# EAGLE design quadcopter (EAGLE 9.7.0)
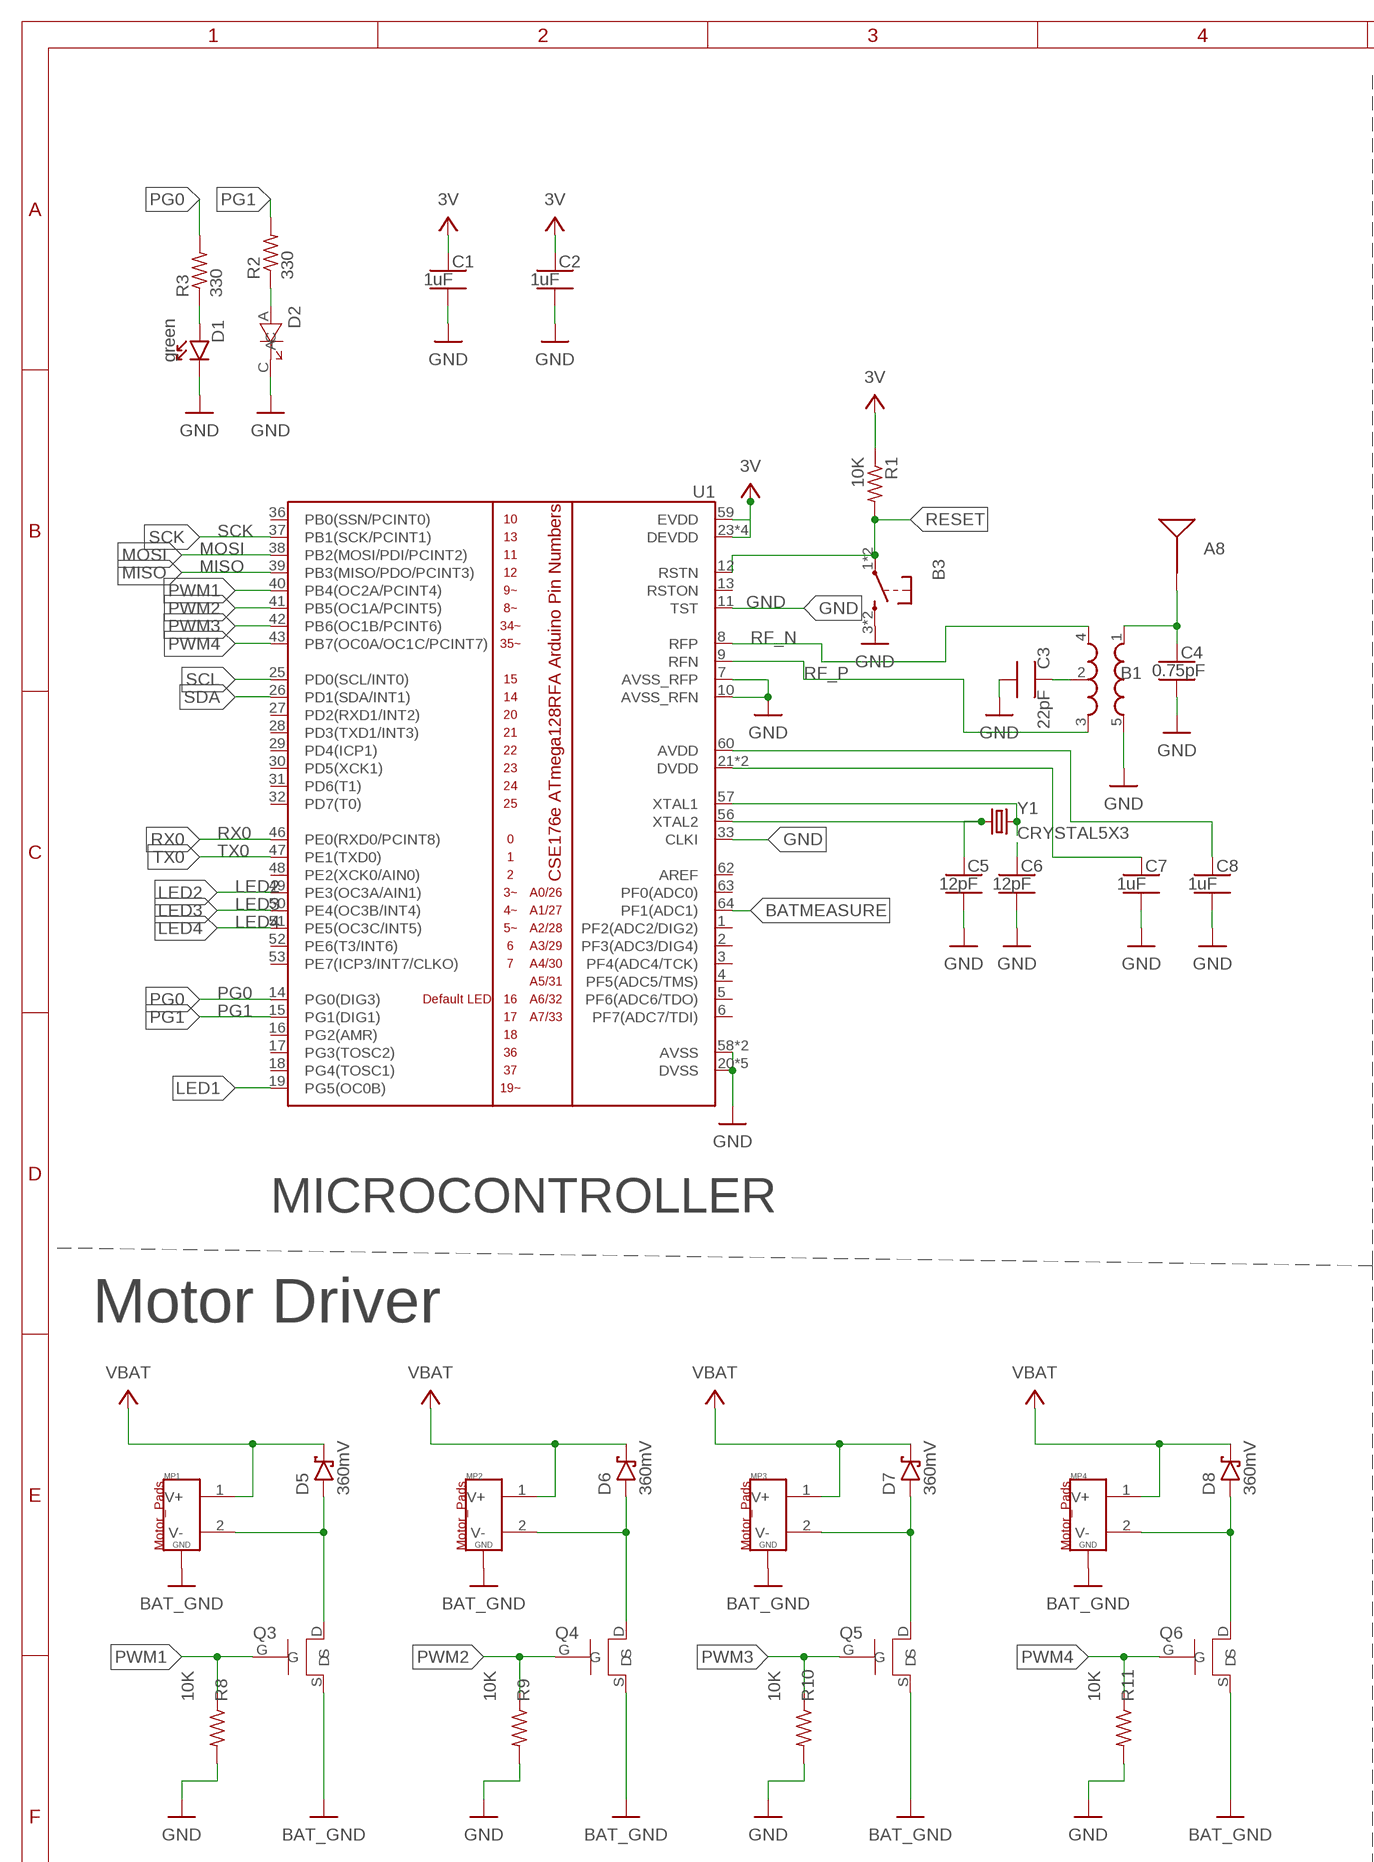
[diagram p0: schematic, sheet 1, part 1 of 2]
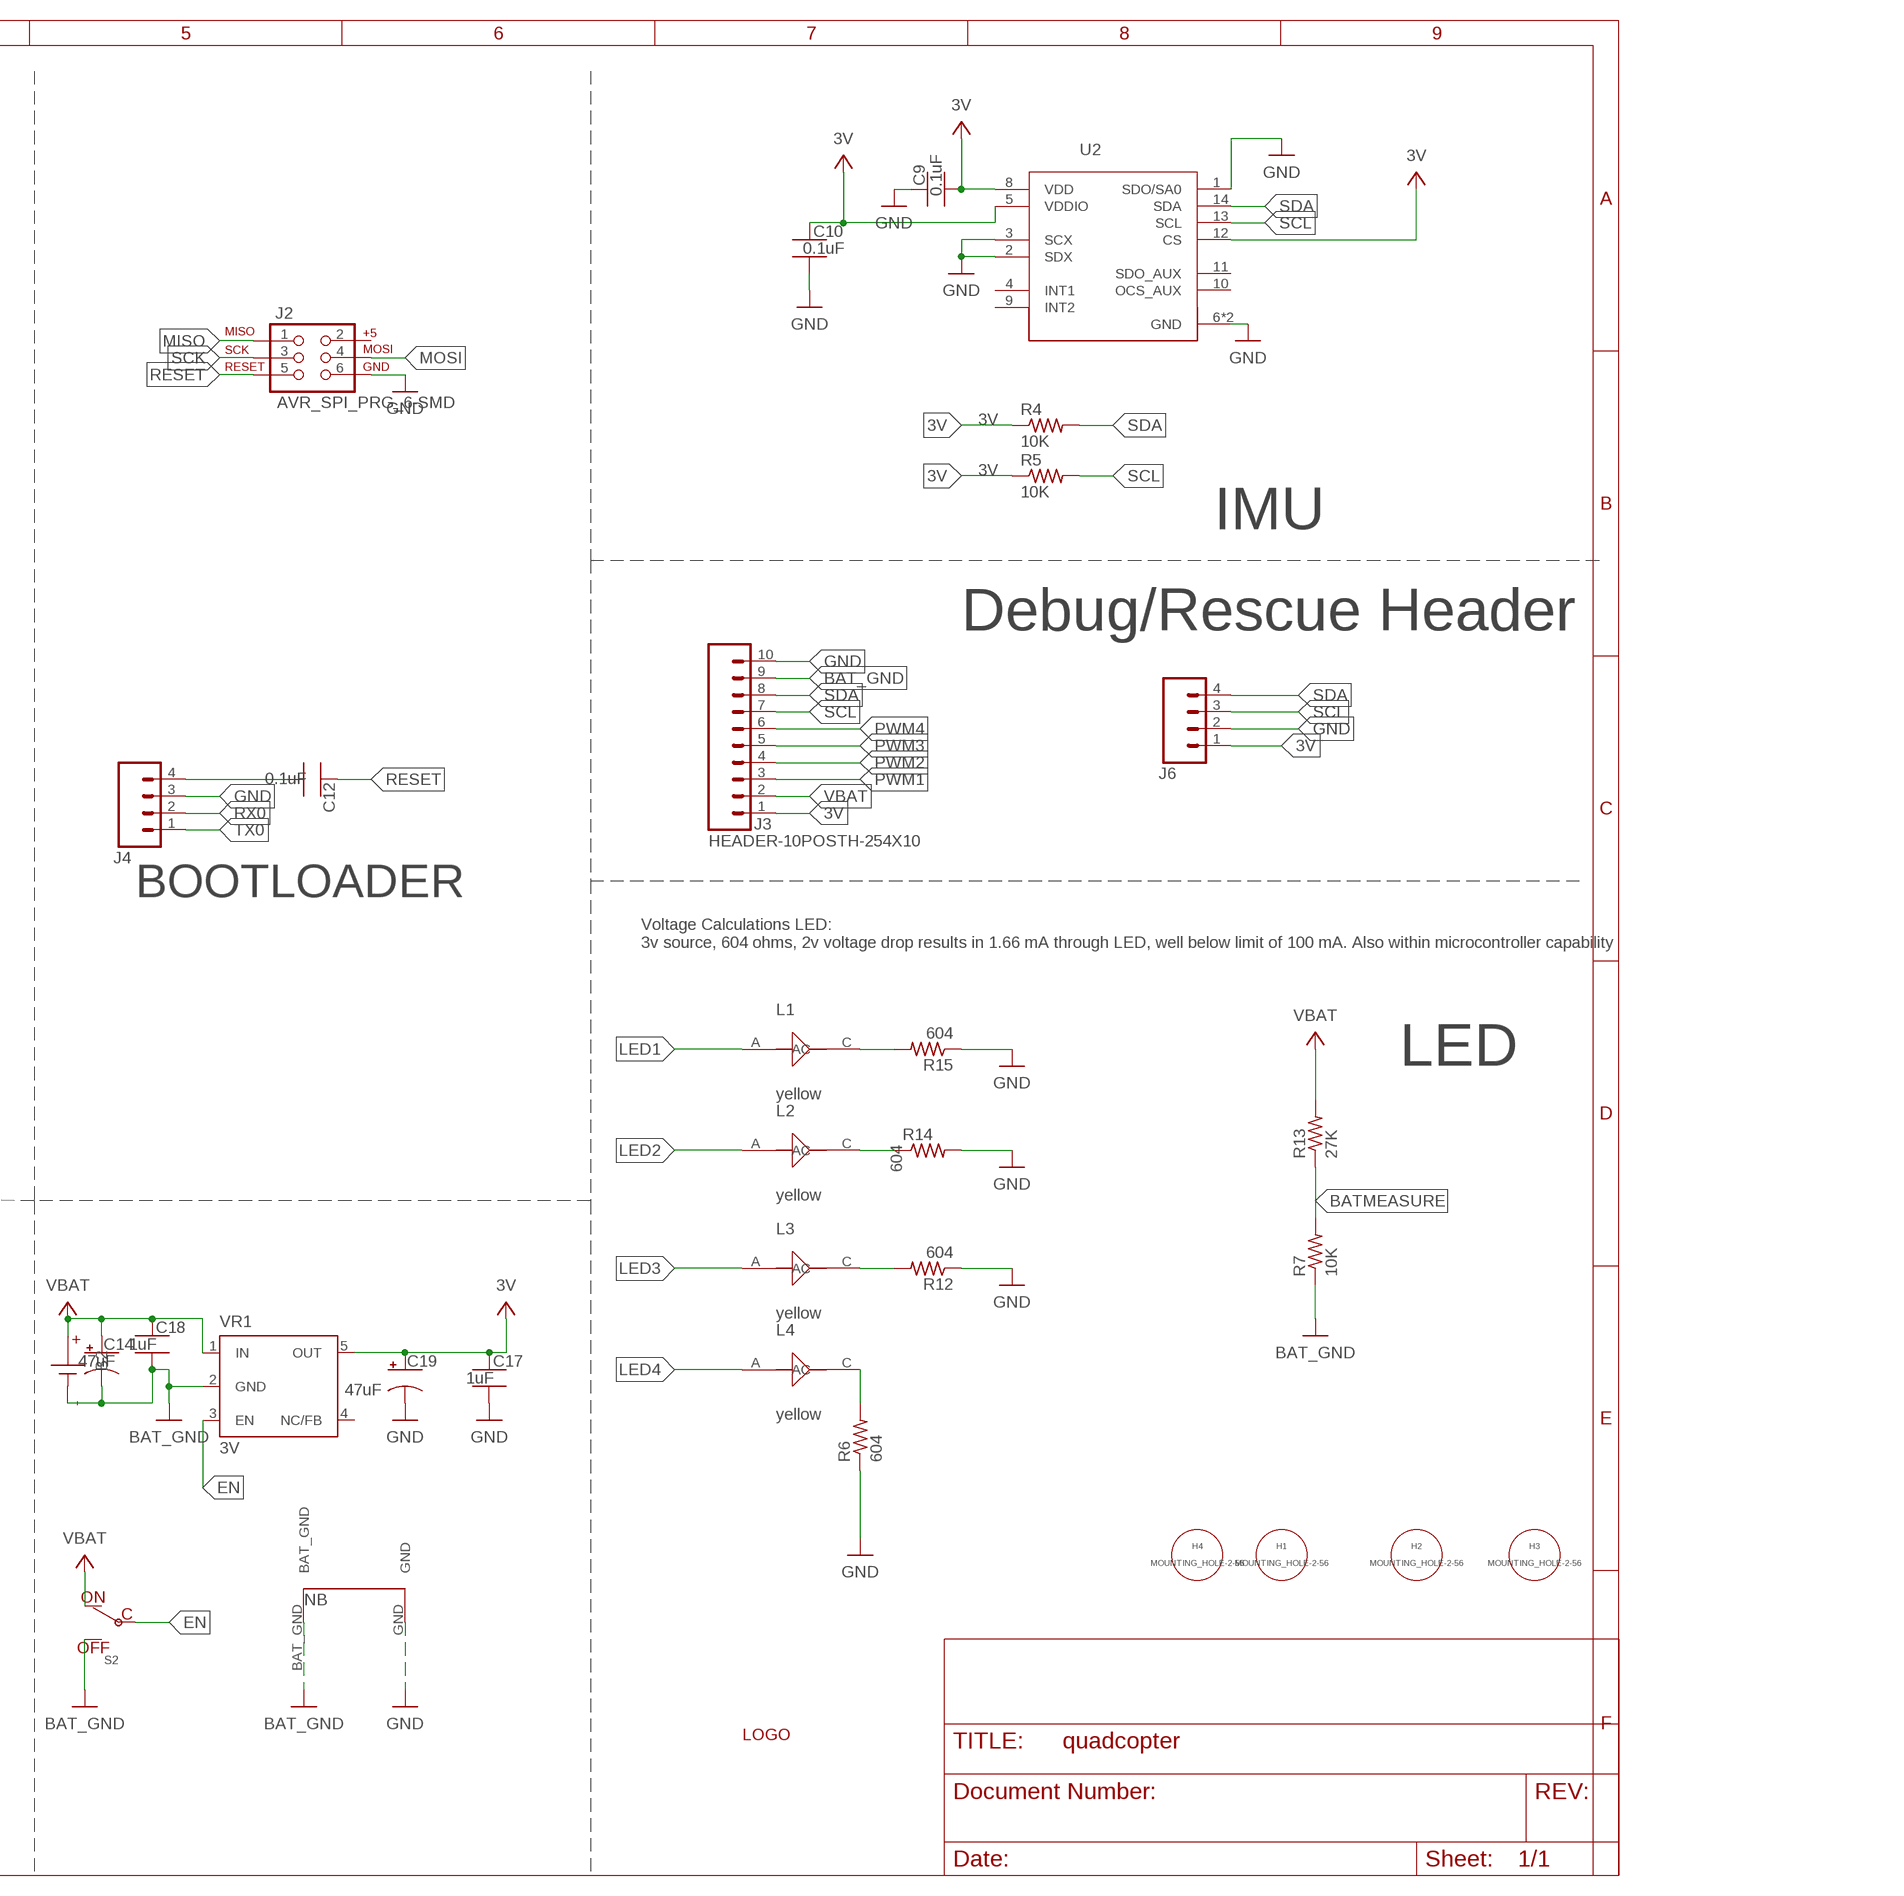
[diagram p1: schematic, sheet 1, part 2 of 2]
FRAME1 (FRAME_B_L): CREATOR: Unknown; DIST: Unknown; DISTPN: Unknown

## Parts
A8  ANTENNA-BOARD  [ANT_PCB_2.4GHZ_NRF8001_1.6MM_1OZ]
B1  BALUN0805  [BALUN]
B2  BATTERY-SCREW-TERMINAL  [SCREW-TERMINAL-1X2-2.54MM]
B3  PUSHBUTTON_SMD-VERTICAL-1  [TE_FSM8JSMA_HS]
C1  1uF  CAPACITOR-NP_SMD-2012-0805_CERAMIC-1UF  [CAPC2012X140_HS]
C2  1uF  CAPACITOR-NP_SMD-2012-0805_CERAMIC-1UF  [CAPC2012X140_HS]
C3  22pF  CAPACITOR-NP_SMD-2012-0805_CERAMIC-22PF  [CAPC2012X140_HS]
C4  0.75pF  CAPACITOR-NP_SMD-2012-0805_CERAMIC-0.75PF  [CAPC2012X140_HS]
C5  12pF  CAPACITOR-NP_SMD-2012-0805_CERAMIC-12PF  [CAPC2012X140_HS]
C6  12pF  CAPACITOR-NP_SMD-2012-0805_CERAMIC-12PF  [CAPC2012X140_HS]
C7  1uF  CAPACITOR-NP_SMD-2012-0805_CERAMIC-1UF  [CAPC2012X140_HS]
C8  1uF  CAPACITOR-NP_SMD-2012-0805_CERAMIC-1UF  [CAPC2012X140_HS]
C9  0.1uF  CAPACITOR-NP_SMD-2012-0805_CERAMIC-0.1UF  [CAPC2012X140_HS]
C10  0.1uF  CAPACITOR-NP_SMD-2012-0805_CERAMIC-0.1UF  [CAPC2012X140_HS]
C12  0.1uF  CAPACITOR-NP_SMD-2012-0805_CERAMIC-0.1UF  [CAPC2012X140_HS]
C14  47uF  CAPACITOR-POL_47UF-SMD-1206-TAJA  [CAPMP3216X180]
C17  1uF  CAPACITOR-NP_SMD-2012-0805_CERAMIC-1UF  [CAPC2012X140_HS]
C18  1uF  CAPACITOR-NP_SMD-2012-0805_CERAMIC-1UF  [CAPC2012X140_HS]
C19  47uF  CAPACITOR-POL_47UF-SMD-1206-TAJA  [CAPMP3216X180]
D1  green  DIODE-LED_SMD-2012-0805-GREEN  [LEDSC125X200X120-2_HS]
D2  LED-RED-160-1178-1-ND  [LED_160-1178-1-ND]
D5  360mV  DIODE-SCHOTTKY_-SMD-SOD123  [SODFL3516X96]
D6  360mV  DIODE-SCHOTTKY_-SMD-SOD123  [SODFL3516X96]
D7  360mV  DIODE-SCHOTTKY_-SMD-SOD123  [SODFL3516X96]
D8  360mV  DIODE-SCHOTTKY_-SMD-SOD123  [SODFL3516X96]
H1  MOUNTING_HOLE-2-56  [2-56-MOUNTING-HOLE-NO-METAL]
H2  MOUNTING_HOLE-2-56  [2-56-MOUNTING-HOLE-NO-METAL]
H3  MOUNTING_HOLE-2-56  [2-56-MOUNTING-HOLE-NO-METAL]
H4  MOUNTING_HOLE-2-56  [2-56-MOUNTING-HOLE-NO-METAL]
J2  AVR_SPI_PRG_6-SMD  [2X3-SMD]
J3  HEADER-10POSTH-254X10  [HDRV10W63P254_10X1_2540X254H838_HS]
J4  HEADER-4POS-0.1IN-FEMALE-SMD-BOTTOM-ENTRY  [HEADER-1X4-BOTTOM-ENTRY]
J6  HEADER-4POS-0.1IN-FEMALE  [HDRVR4W80P254_1X4_1066X254X850B]
L1  yellow  LED_YELLOW  [LEDC1507X80NYELLOW]
L2  yellow  LED_YELLOW  [LEDC1507X80NYELLOW]
L3  yellow  LED_YELLOW  [LEDC1507X80NYELLOW]
L4  yellow  LED_YELLOW  [LEDC1507X80NYELLOW]
LOGO  PIDLOGO  [PIDLOGO]
MP1  MOTOR_PADS_GND-MOLEX-SMD  [MOLEX-0532610271]
MP2  MOTOR_PADS_GND-MOLEX-SMD  [MOLEX-0532610271]
MP3  MOTOR_PADS_GND-MOLEX-SMD  [MOLEX-0532610271]
MP4  MOTOR_PADS_GND-MOLEX-SMD  [MOLEX-0532610271]
NB  NETBRIDGE  [NETBRIDGE]
Q3  MOSFET-FET-SI2302CDS-T1-E3CT-NDSI2302CDS-T1-E3CT-ND  [MOSFET_FET_SI2302CDS-T1-E3CT-ND]
Q4  MOSFET-FET-SI2302CDS-T1-E3CT-NDSI2302CDS-T1-E3CT-ND  [MOSFET_FET_SI2302CDS-T1-E3CT-ND]
Q5  MOSFET-FET-SI2302CDS-T1-E3CT-NDSI2302CDS-T1-E3CT-ND  [MOSFET_FET_SI2302CDS-T1-E3CT-ND]
Q6  MOSFET-FET-SI2302CDS-T1-E3CT-NDSI2302CDS-T1-E3CT-ND  [MOSFET_FET_SI2302CDS-T1-E3CT-ND]
R1  10K  RESISTOR_SMD-2012-0805-10K  [RESC2012X60_HS]
R2  330  RESISTOR_SMD-2012-0805-330  [RESC2012X60_HS]
R3  330  RESISTOR_SMD-2012-0805-330  [RESC2012X60_HS]
R4  10K  RESISTOR_SMD-2012-0805-10K  [RESC2012X60_HS]
R5  10K  RESISTOR_SMD-2012-0805-10K  [RESC2012X60_HS]
R6  604  RESISTOR_SMD-2012-0805-604  [RESC2012X60_HS]
R7  10K  RESISTOR_SMD-2012-0805-10K  [RESC2012X60_HS]
R8  10K  RESISTOR_SMD-2012-0805-10K  [RESC2012X60_HS]
R9  10K  RESISTOR_SMD-2012-0805-10K  [RESC2012X60_HS]
R10  10K  RESISTOR_SMD-2012-0805-10K  [RESC2012X60_HS]
R11  10K  RESISTOR_SMD-2012-0805-10K  [RESC2012X60_HS]
R12  604  RESISTOR_SMD-2012-0805-604  [RESC2012X60_HS]
R13  27K  RESISTOR_SMD-2012-0805-27K  [RESC2012X60_HS]
R14  604  RESISTOR_SMD-2012-0805-604  [RESC2012X60_HS]
R15  604  RESISTOR_SMD-2012-0805-604  [RESC2012X60_HS]
S2  POWER-SWITCH-MFS201N-9-Z-SMD-EDGE  [JS102011SAQN]
U1  ATMEGA128RFA1  [QFN-64]
U2  IMU-LSM6DSOXTR-497-18367-1-ND497-18367-1-ND  [LSM6DS0]
VR1  3V  TPS73633-DBVT3V  [SOT23-DBV]
Y1  CRYSTAL5X3  [CRYSTAL-SMD-5X3]

## Nets
3V [PWR]: C1.1 C2.1 C9.2 C10.1 C17.1 C19.1(+) J3.1 J6.1 R1.1 R4.1 R5.1 U1.23(DEVDD) U1.34(DEVDD) U1.44(DEVDD) U1.54(DEVDD) U1.59(EVDD) U2.5(VDDIO) U2.8(VDD) U2.12(CS) VR1.5(OUT)
BAT_GND [HIGH-I]: B2.1(N) C14.2(-) C18.2 J3.9 MP1.G1(GND) MP1.G2(GND) MP2.G1(GND) MP2.G2(GND) MP3.G1(GND) MP3.G2(GND) MP4.G1(GND) MP4.G2(GND) NB.BAT_GND Q3.S Q4.S Q5.S Q6.S R7.1 S2.A(OFF) VR1.2(GND)
BATMEASURE: R7.2 R13.1 U1.64(PF1(ADC1))
EN: S2.C VR1.3(EN)
GND [PWR]: B1.5(GND) B3.3 B3.4 C1.2 C2.2 C3.2 C4.2 C5.2 C6.2 C7.2 C8.2 C9.1 C10.2 C17.2 C19.2(-) D1.C D2.C J2.6 J3.10 J4.3 J6.2 NB.GND R6.1 R8.2 R9.2 R10.2 R11.2 R12.1 R14.2 R15.1 U1.7(AVSS_RFP) U1.10(AVSS_RFN) U1.11(TST) U1.20(DVSS) U1.24(DVSS) U1.33(CLKI) U1.35(DVSS) U1.45(DVSS) U1.55(DVSS) U1.58(AVSS) U1.61(AVSS) U2.1(SDO/SA0) U2.2(SDX) U2.3(SCX) U2.6(GND) U2.7(GND)
LED1: L1.A U1.19(PG5(OC0B))
LED2: L2.A U1.49(PE3(OC3A/AIN1))
LED3: L3.A U1.50(PE4(OC3B/INT4))
LED4: L4.A U1.51(PE5(OC3C/INT5))
MISO: J2.1 U1.39(PB3(MISO/PDO/PCINT3))
MOSI: J2.4 U1.38(PB2(MOSI/PDI/PCINT2))
N$1: D1.A R3.1
N$2: D2.A R2.1
N$5: B1.2(GND) C3.1
N$7 [RFSIG]: A8.FEED(SIGNAL) B1.1(IN) C4.1
N$8: C8.1 U1.60(AVDD)
N$9: C7.1 U1.21(DVDD) U1.22(DVDD)
N$10: C6.1 U1.57(XTAL1) Y1.3
N$11: C5.1 U1.56(XTAL2) Y1.1
N$12: L1.C R15.2
N$13: C12.2 J4.4
N$14: L4.C R6.2
N$15: L2.C R14.1
N$16: L3.C R12.2
N$18 [HIGH-I]: D5.2(A) MP1.2(V-) Q3.D
N$19 [HIGH-I]: D6.2(A) MP2.2(V-) Q4.D
N$20 [HIGH-I]: D7.2(A) MP3.2(V-) Q5.D
N$21 [HIGH-I]: D8.2(A) MP4.2(V-) Q6.D
PG0: R3.2 U1.14(PG0(DIG3))
PG1: R2.2 U1.15(PG1(DIG1))
PWM1: J3.3 Q3.G R8.1 U1.40(PB4(OC2A/PCINT4))
PWM2: J3.4 Q4.G R9.1 U1.41(PB5(OC1A/PCINT5))
PWM3: J3.5 Q5.G R10.1 U1.42(PB6(OC1B/PCINT6))
PWM4: J3.6 Q6.G R11.1 U1.43(PB7(OC0A/OC1C/PCINT7))
RESET: B3.1 B3.2 C12.1 J2.5 R1.2 U1.12(RSTN)
RF_N: B1.4(OUT1) U1.8(RFP)
RF_P: B1.3(OUT2) U1.9(RFN)
RX0: J4.2 U1.46(PE0(RXD0/PCINT8))
SCK: J2.3 U1.37(PB1(SCK/PCINT1))
SCL: J3.7 J6.3 R5.2 U1.25(PD0(SCL/INT0)) U2.13(SCL)
SDA: J3.8 J6.4 R4.2 U1.26(PD1(SDA/INT1)) U2.14(SDA)
TX0: J4.1 U1.47(PE1(TXD0))
VBAT [HIGH-I]: B2.2(P) C14.1(+) C18.1 D5.1(C) D6.1(C) D7.1(C) D8.1(C) J3.2 MP1.1(V+) MP2.1(V+) MP3.1(V+) MP4.1(V+) R13.2 S2.B(ON) VR1.1(IN)
Unconnected: J2.2 U1.1(PF2(ADC2/DIG2)) U1.2(PF3(ADC3/DIG4)) U1.3(PF4(ADC4/TCK)) U1.4(PF5(ADC5/TMS)) U1.5(PF6(ADC6/TDO)) U1.6(PF7(ADC7/TDI)) U1.13(RSTON) U1.16(PG2(AMR)) U1.17(PG3(TOSC2)) U1.18(PG4(TOSC1)) U1.27(PD2(RXD1/INT2)) U1.28(PD3(TXD1/INT3)) U1.29(PD4(ICP1)) U1.30(PD5(XCK1)) U1.31(PD6(T1)) U1.32(PD7(T0)) U1.36(PB0(SSN/PCINT0)) U1.48(PE2(XCK0/AIN0)) U1.52(PE6(T3/INT6)) U1.53(PE7(ICP3/INT7/CLKO)) U1.62(AREF) U1.63(PF0(ADC0)) U2.4(INT1) U2.9(INT2) U2.10(OCS_AUX) U2.11(SDO_AUX) VR1.4(NC/FB)

## Notes on the sheet
- IMU
- Debug/Rescue Header
- BOOTLOADER
- Voltage Calculations LED:
  3v source, 604 ohms, 2v voltage drop results in 1.66 mA through LED, well below limit of 100 mA. Also within microcontroller capability
- LED
- MICROCONTROLLER
- Motor Driver

## Library data of the parts
A8 = quadparts_prebuilt_2022:ANTENNA: Single endded antenna.; CREATOR: Swanson; DESC: trace antenna; DIST: NA; DISTPN: NA; MFR: NA; MOUNTING: NONE; MPN: NA; POPULATE: NO
B1 = quadparts_prebuilt_2022:BALUN: A balun to convert differential radio-frequency outputs from the microcontroller into a single-ended driver for the antenna.; CREATOR: Swanson; DATASHEET: http://katalog.we-online.de/pbs/datasheet/748421245.pdf; DESC: BALUN 2.4GHZ-2.5GHZ 50/100 0805; DIST: Digikey; DISTPN: 732-2230-1-ND; MFR: Wurth Electronics Inc.; MOUNTING: SMD; MPN: 748421245; PACKAGE: 0805; PRICE: 2.63; REVIEWER: Swanson
B2 = quadparts_prebuilt_2022:BATTERY: Connections for a battery.; CREATOR: Swanson; DIST: DIGIKEY; DISTPN: ED10561-ND; MOUNTING: TH; PIN1: -; PIN2: +
B3 = quadparts_prebuilt_2022:PUSHBUTTON_: "Tactile" or "clicky" button.; CREATOR: Swanson; DIST: Digikey; DISTPN: 450-1129-ND; MFR: TE Connectivity Alcoswitch Switches; MOUNTING: SMD; MPN: FSM4JSMA; REVIEWER: Swanson
C1 C2 C7 C8 C17 C18 = quadparts_prebuilt_2022:CAPACITOR-NP_: Nonpolarized capacitor; CREATOR: Swanson; DIST: Digikey; DISTPN: 587-1281-1-ND; MFR: Taiyo Yuden; MOUNTING: SMD; MPN: TMK212B7105KG-T; REVIEWER: Swanson
C3 = quadparts_prebuilt_2022:CAPACITOR-NP_: Nonpolarized capacitor; CREATOR: Swanson; DESC: CAP CER 22PF 250V C0G/NP0 0805; DIST: Digikey; DISTPN: 490-5534-1-ND; MFR: Murata Electronics; MOUNTING: SMD; MPN: GRM21A5C2E220JW01D; PACKAGE: 0805; REVIEWER: Swanson
C4 = quadparts_prebuilt_2022:CAPACITOR-NP_: Nonpolarized capacitor; CREATOR: Swanson; DESC: CAP CER 0.75PF 100V C0G/NP0 0805; DIST: Digikey; DISTPN: 490-3585-1-ND; MFR: Murata Electronics; MOUNTING: SMD; MPN: GQM2195C2AR75CB01D; PACKAGE: 0805; REVIEWER: Swanson
C5 C6 = quadparts_prebuilt_2022:CAPACITOR-NP_: Nonpolarized capacitor; CREATOR: Swanson; DESC: CAP CER 12PF 250V C0G/NP0 0805; DIST: Digikey; DISTPN: 490-5531-1-ND; MFR: Murata Electronics; MOUNTING: SMD; MPN: GRM21A5C2E120JW01D; PACKAGE: 0805; REVIEWER: Swanson
C9 C10 C12 = quadparts_prebuilt_2022:CAPACITOR-NP_: Nonpolarized capacitor; CREATOR: Swanson; DESC: CAP CER 0.1UF 100V X7R 0805; DIST: Digikey; DISTPN: 445-1418-1-ND; MFR: TDK Corporation; MOUNTING: SMD; MPN: C2012X7R2A104K125AA; PACKAGE: 0805; REVIEWER: Swanson
C14 C19 = quadparts_prebuilt_2022:CAPACITOR-POL_: Polarized capacitor; CREATOR: Swanson; DESC: CAP TANT 47UF 10% 6.3V 1206; DIST: DIGIKEY; DISTPN: 478-11462-1-ND; MFR: AVX Corporation; MOUNTING: SMD; MPN: TAJA476K006SNJV; PACKAGE: 1206
D1 = quadparts_prebuilt_2022:DIODE-LED_: Light emitting diode; CREATOR: Swanson; DIST: Digikey; DISTPN: 160-1179-1-ND; MFR: Lite-On Inc; MOUNTING: SMD; MPN: LTST-C170GKT; REVIEWER: Swanson
D2 = custom_v9:LED; CREATOR: KaustubhKanagalekar; DIST: Digikey; DISTPN: 160-1178-1-ND
D5-D8 = quadparts_prebuilt_2022:DIODE-SCHOTTKY_: Schottky diode; CREATOR: Swanson; DESC: DIODE SCHOTTKY 30V 1.5A SFLAT; DIST: Digikey; DISTPN: CRS08QMCT-ND; MFR: Toshiba Semiconductor and Storage; MOUNTING: SMD; MPN: CRS08(TE85L,Q,M); REVIEWER: Swanson
H1-H4 = quadparts_prebuilt_2022:MOUNTING_HOLE
J2 = quadparts_prebuilt_2022:AVR_SPI_PRG_6: AVR ISP 6 Pin This is the in-system programming (ISP) connector for Atmel Microcontrollers programming.; CREATOR: Swanson; DESC: CONN HEADER SMD 6POS 2.54MM; DIST: Digikey; DISTPN: 609-3487-2-ND; MFR: Amphenol ICC (FCI); MOUNTING: SMD; MPN: 95278-101A06LF
J3 = quadparts_prebuilt_2022:HEADER-10POS: 10 pin single inline pin header, socket, or connector; CREATOR: Swanson; DATASHEET: http://portal.fciconnect.com/Comergent//fci/drawing/68000.pdf; DIST: Digikey; DISTPN: 609-3250-ND; MFR: Amphenol FCI; MOUNTING: TH; MPN: 68000-110HLF; PRICE: 0.55; REVIEWER: Swanson
J4 = quadparts_prebuilt_2022:HEADER-4POS; CREATOR: Swanson; DESC: CONN RCPT 4POS 0.1 GOLD SMD; DIST: DIGIKEY; DISTPN: A121787CT-ND; MFR: TE Connectivity AMP Connectors; MOUNTING: SMD; MPN: 1241152-4
J6 = quadparts_prebuilt_2022:HEADER-4POS; CREATOR: Swanson; DIST: Digikey; DISTPN: S7002-ND
L1-L4 = LED:LED_YELLOW; CREATOR: AlexanderHaken; CUSTOM: CUSTOM; DIST: Digikey; DISTPN: 150060YS75000
LOGO = logo:PIDLOGO
MP1-MP4 = quadparts_prebuilt_2022:MOTOR_PADS_GND: Connections a brushed motor.; CREATOR: Swanson; DESC: CONN HEADER SMD R/A 2POS 1.25MM; DIST: DIGIKEY; DISTPN: WM7620CT-ND; MFR: Molex; MOUNTING: SMD; MPN: 532610271
NB = custom_v9:NETBRIDGE
Q3-Q6 = custom_v9:MOSFET-FET-SI2302CDS-T1-E3CT-ND; CREATOR: KaustubhKanagalekar; DIST: Digikey; DISTPN: SI2302CDS-T1-E3CT-ND
R1 R4 R5 R7-R11 = quadparts_prebuilt_2022:RESISTOR_: Resistor; CREATOR: Swanson; DESC: RES SMD 10K OHM 5% 1/8W 0805; DIST: Digikey; DISTPN: 311-10KARCT-ND; MFR: Yageo; MOUNTING: SMD; MPN: RC0805JR-0710KL; PACKAGE: 0805; REVIEWER: Swanson
R2 R3 = quadparts_prebuilt_2022:RESISTOR_: Resistor; CREATOR: Swanson; DIST: Digikey; DISTPN: 311-330ARCT-ND; MFR: Yageo; MOUNTING: SMD; MPN: RC0805JR-07330RL; REVIEWER: Swanson
R6 R12 R14 R15 = quadparts_prebuilt_2022:RESISTOR_: Resistor; CREATOR: Swanson; DIST: DIGIKEY; DISTPN: 311-604CRCT-ND; MOUNTING: SMD
R13 = quadparts_prebuilt_2022:RESISTOR_: Resistor; CREATOR: Swanson; DIST: DIGIKEY; DISTPN: 311-27.0KCRCT-ND; MOUNTING: SMD
S2 = quadparts_prebuilt_2022:POWER-SWITCH-MFS201N-9-Z; CREATOR: Swanson; DESC: SWITCH SLIDE SPDT 300MA 6V; DIST: DIGIKEY; DISTPN: 401-1999-1-ND; MFR: C&K; MOUNTING: SMD; MPN: JS102011SAQN
U1 = quadparts_prebuilt_2022:ATMEGA128RFA1: ATmega128RFA1 8-bit AVR Microcontroller with Low Power 2.4GHz Transceiver for ZigBee and IEEE 802.15.4; CREATOR: Swanson; DATASHEET: http://www.atmel.com/Images/Atmel-8266-MCU_Wireless-ATmega128RFA1_Datasheet.pdf; DESC: IC RF TXRX+MCU 802.15.4 64VFQFN; DIST: Digikey; DISTPN: ATMEGA128RFA1-ZU-ND; MFR: Microchip Technology; MOUNTING: SMD; MPN: ATMEGA128RFA1-ZU; PACKAGE: QFN; PRICE: 10.21; REVIEWER: Swanson
U2 = custom_v9:IMU-LSM6DSOXTR-497-18367-1-ND; CREATOR: KaustubhKanagalekar; DIST: Digikey; DISTPN: 497-18367-1-ND
VR1 = quadparts_prebuilt_2022:TPS73633-DBVT: LP3985-series voltage regulators.; CREATOR: Swanson; DATASHEET: http://www.ti.com/lit/ds/symlink/lp3985.pdf; DIST: Digikey; DISTPN: LP3985IM5X-3.0/NOPBCT-ND; MFR: Texas Instruments; MOUNTING: SMD; MPN: LP3985IM5X-3.0/NOPB; PRICE: 0.59; REVIEWER: Swanson
Y1 = quadparts_prebuilt_2022:CRYSTAL: Crystals to provide clock references for microcontrollers, etc.; CREATOR: Swanson; DATASHEET: http://www.abracon.com/Resonators/abm3b.pdf; DESC: CRYSTAL 16.0000MHZ 18PF SMD; DIST: Digikey; DISTPN: 535-9122-1-ND; MFR: Abracon LLC; MOUNTING: SMD; MPN: ABM3B-16.000MHZ-B2-T; PRICE: 0.68; PROD_ID: XTAL-08218; REVIEWER: Swanson

## Net classes
1 HIGH-I: width 0.5 mm
3 PWR: width 0.254 mm

## Board
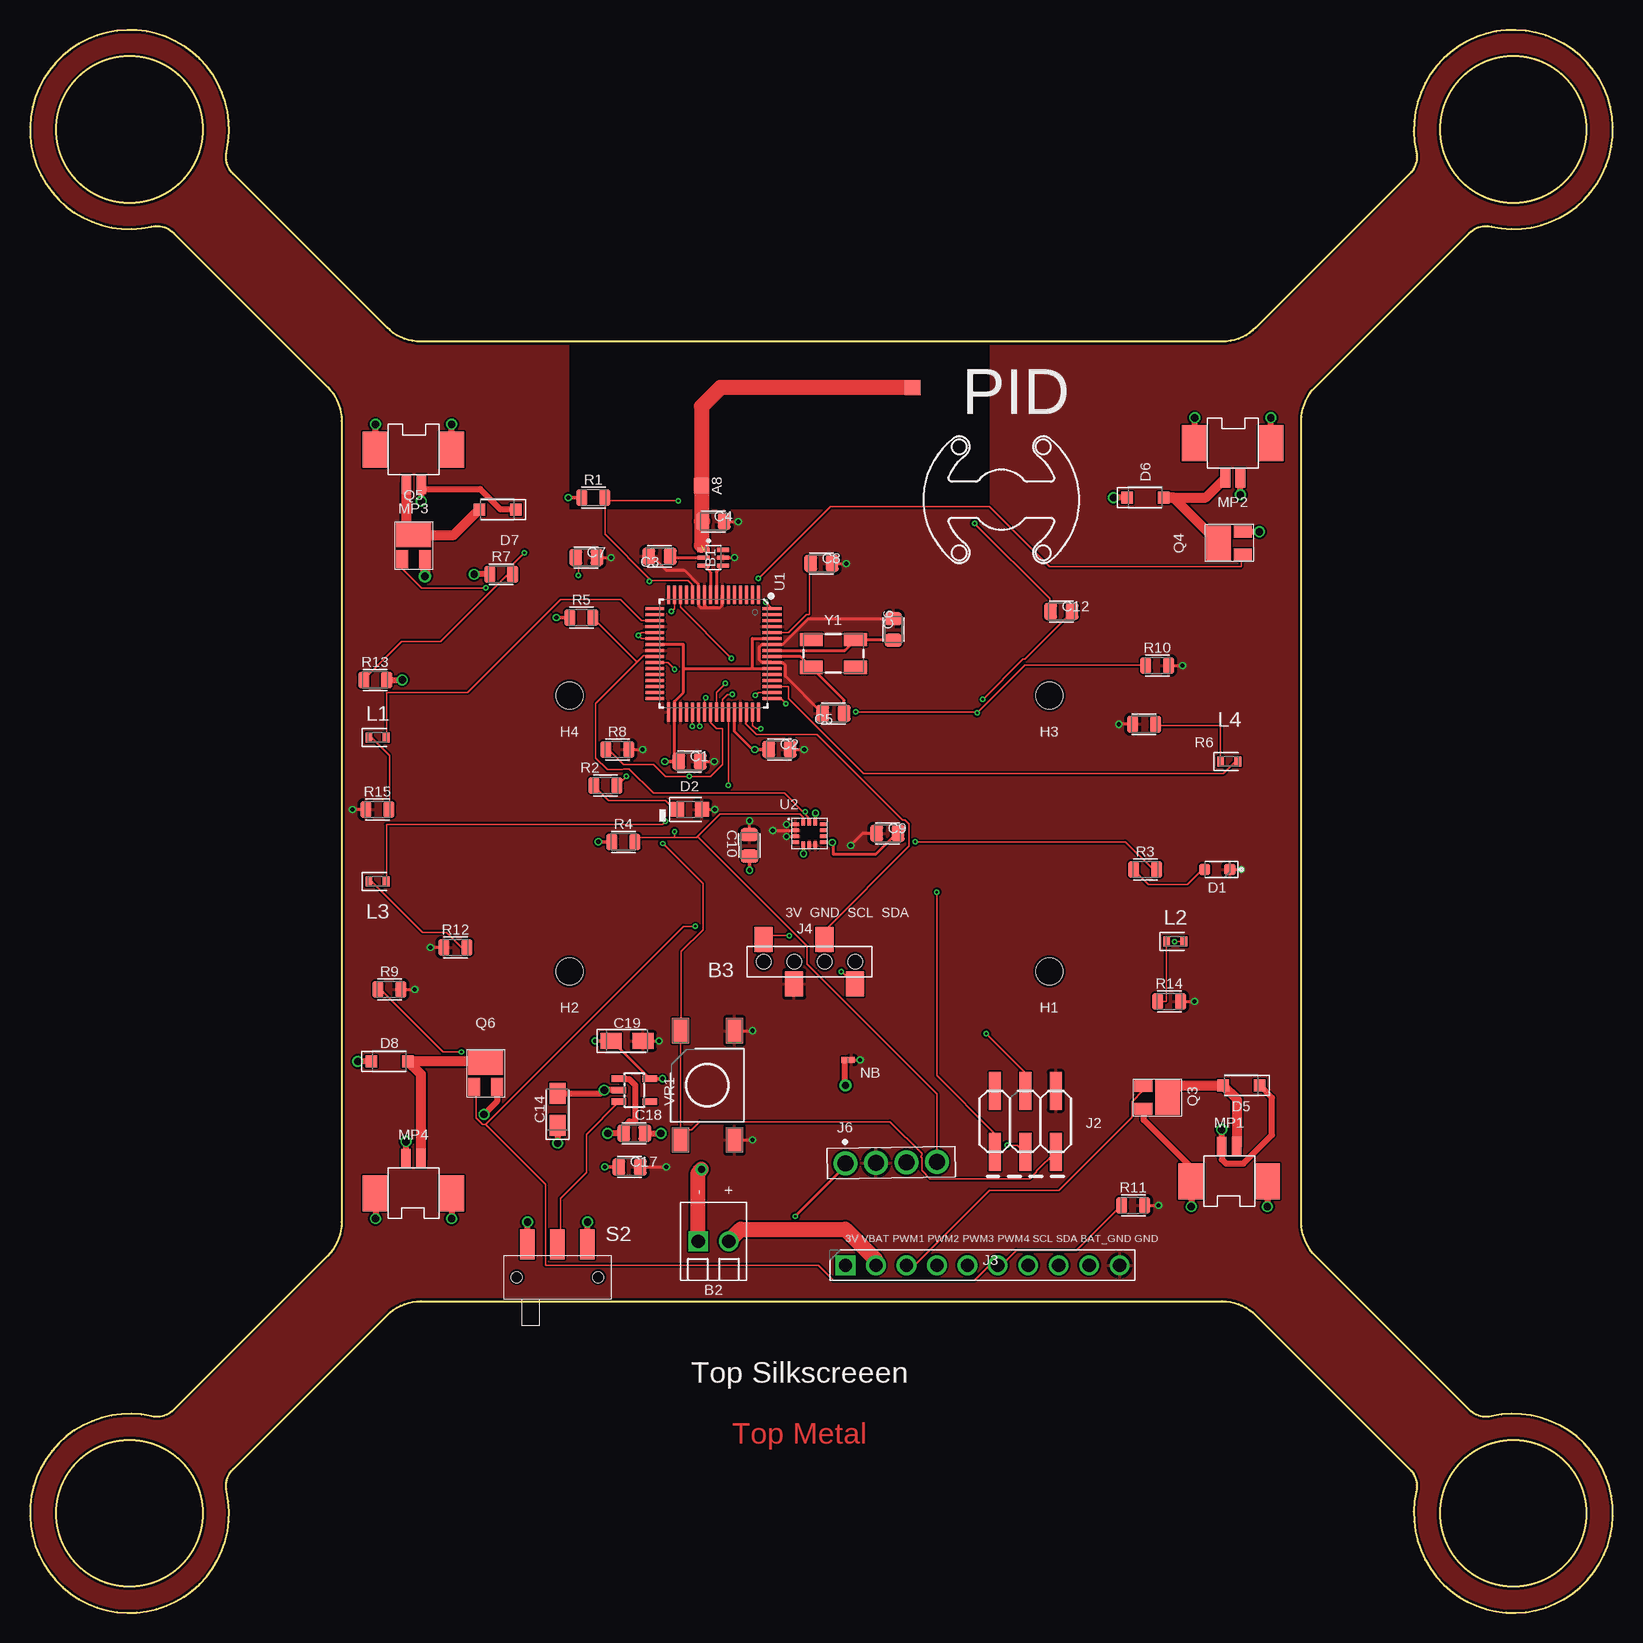
[diagram p2: board, top side]
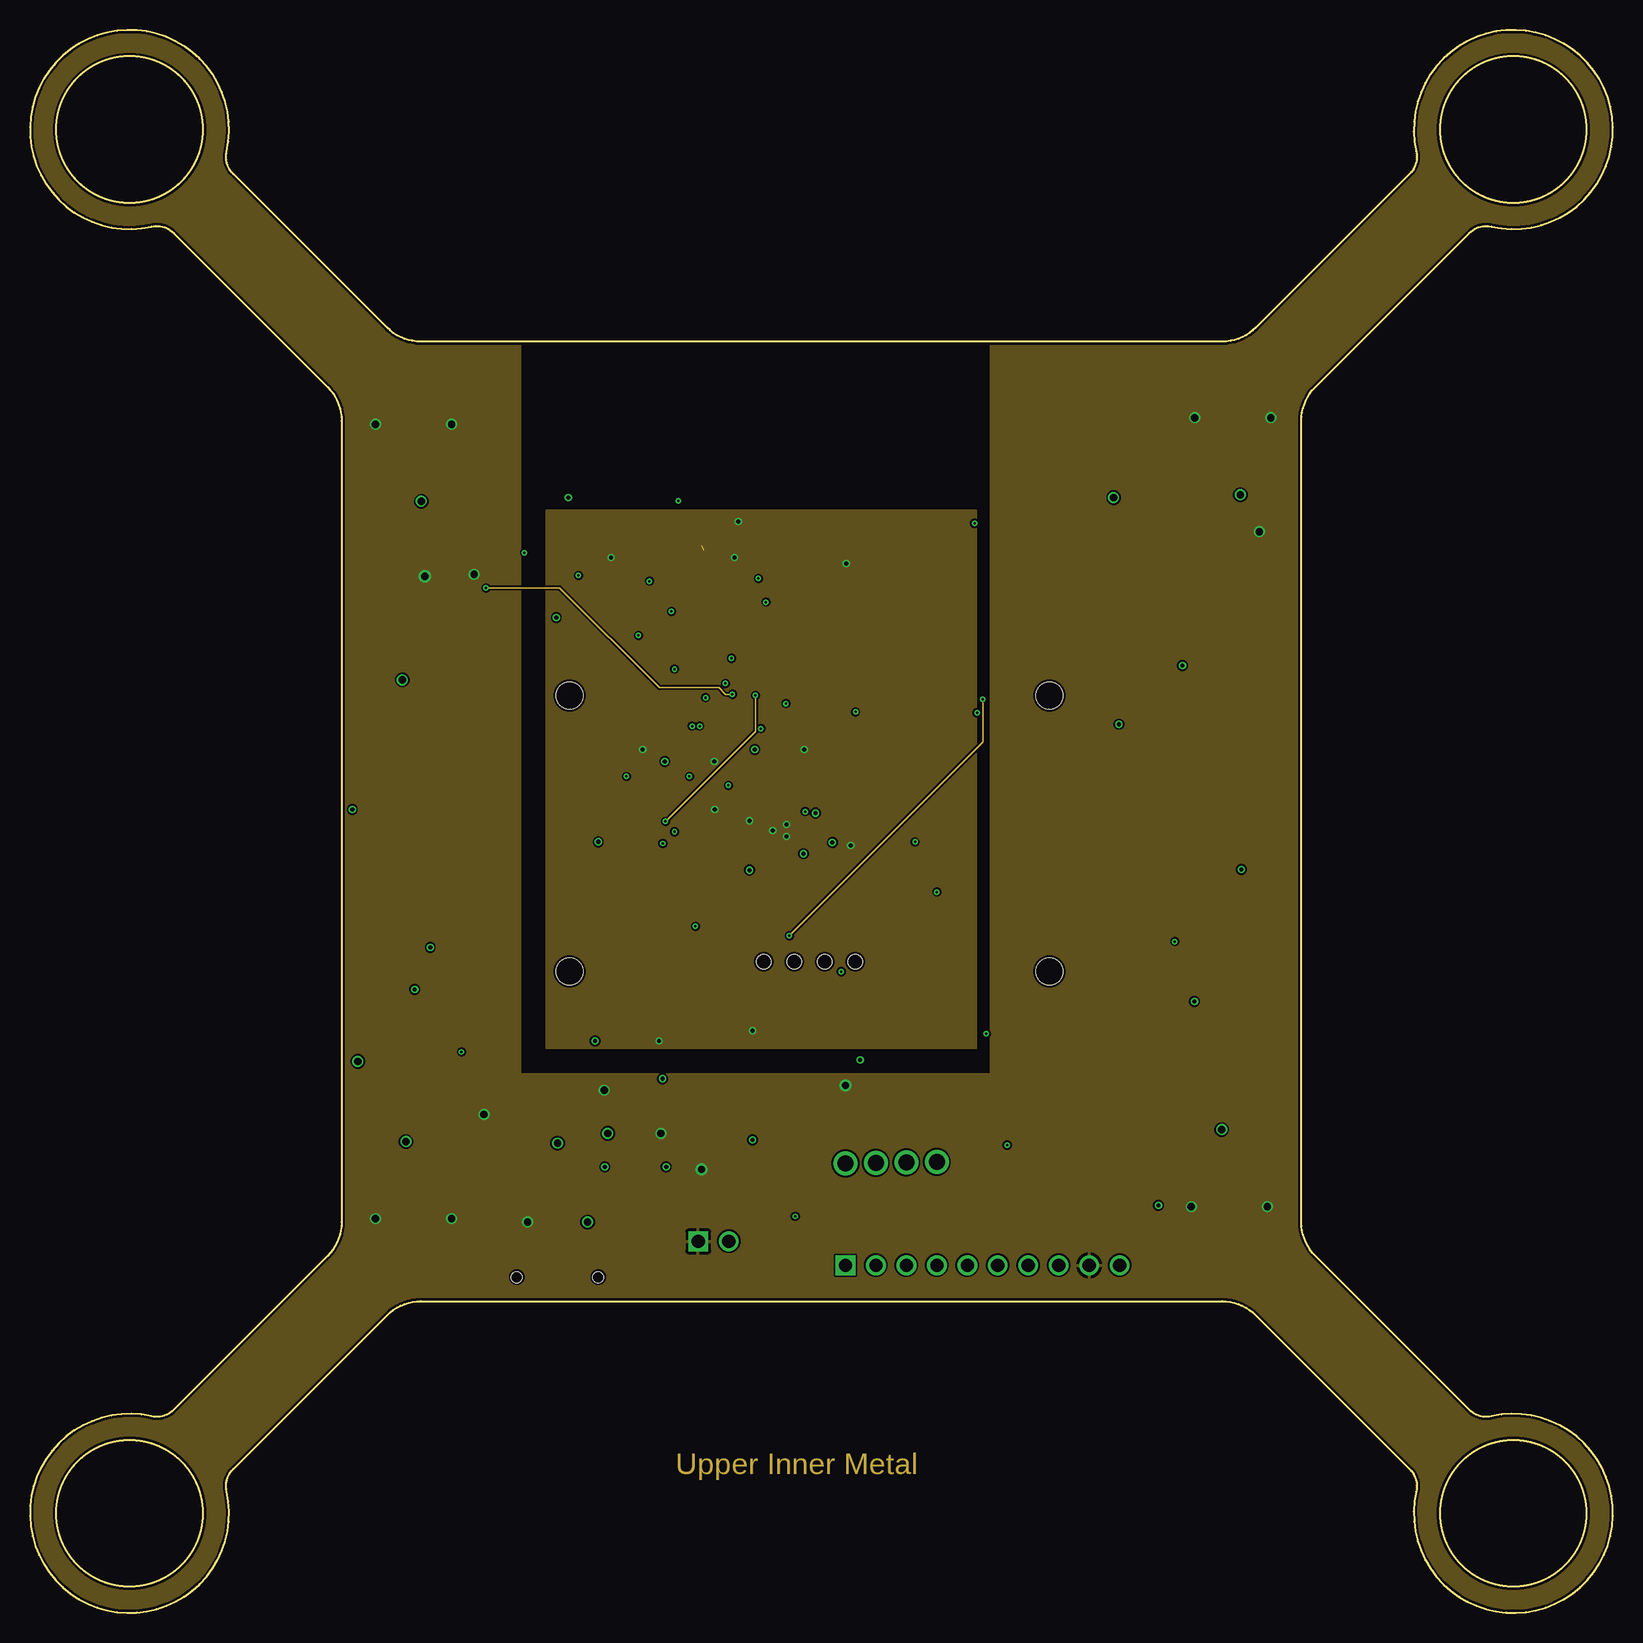
[diagram p3: board, inner layer Route2]
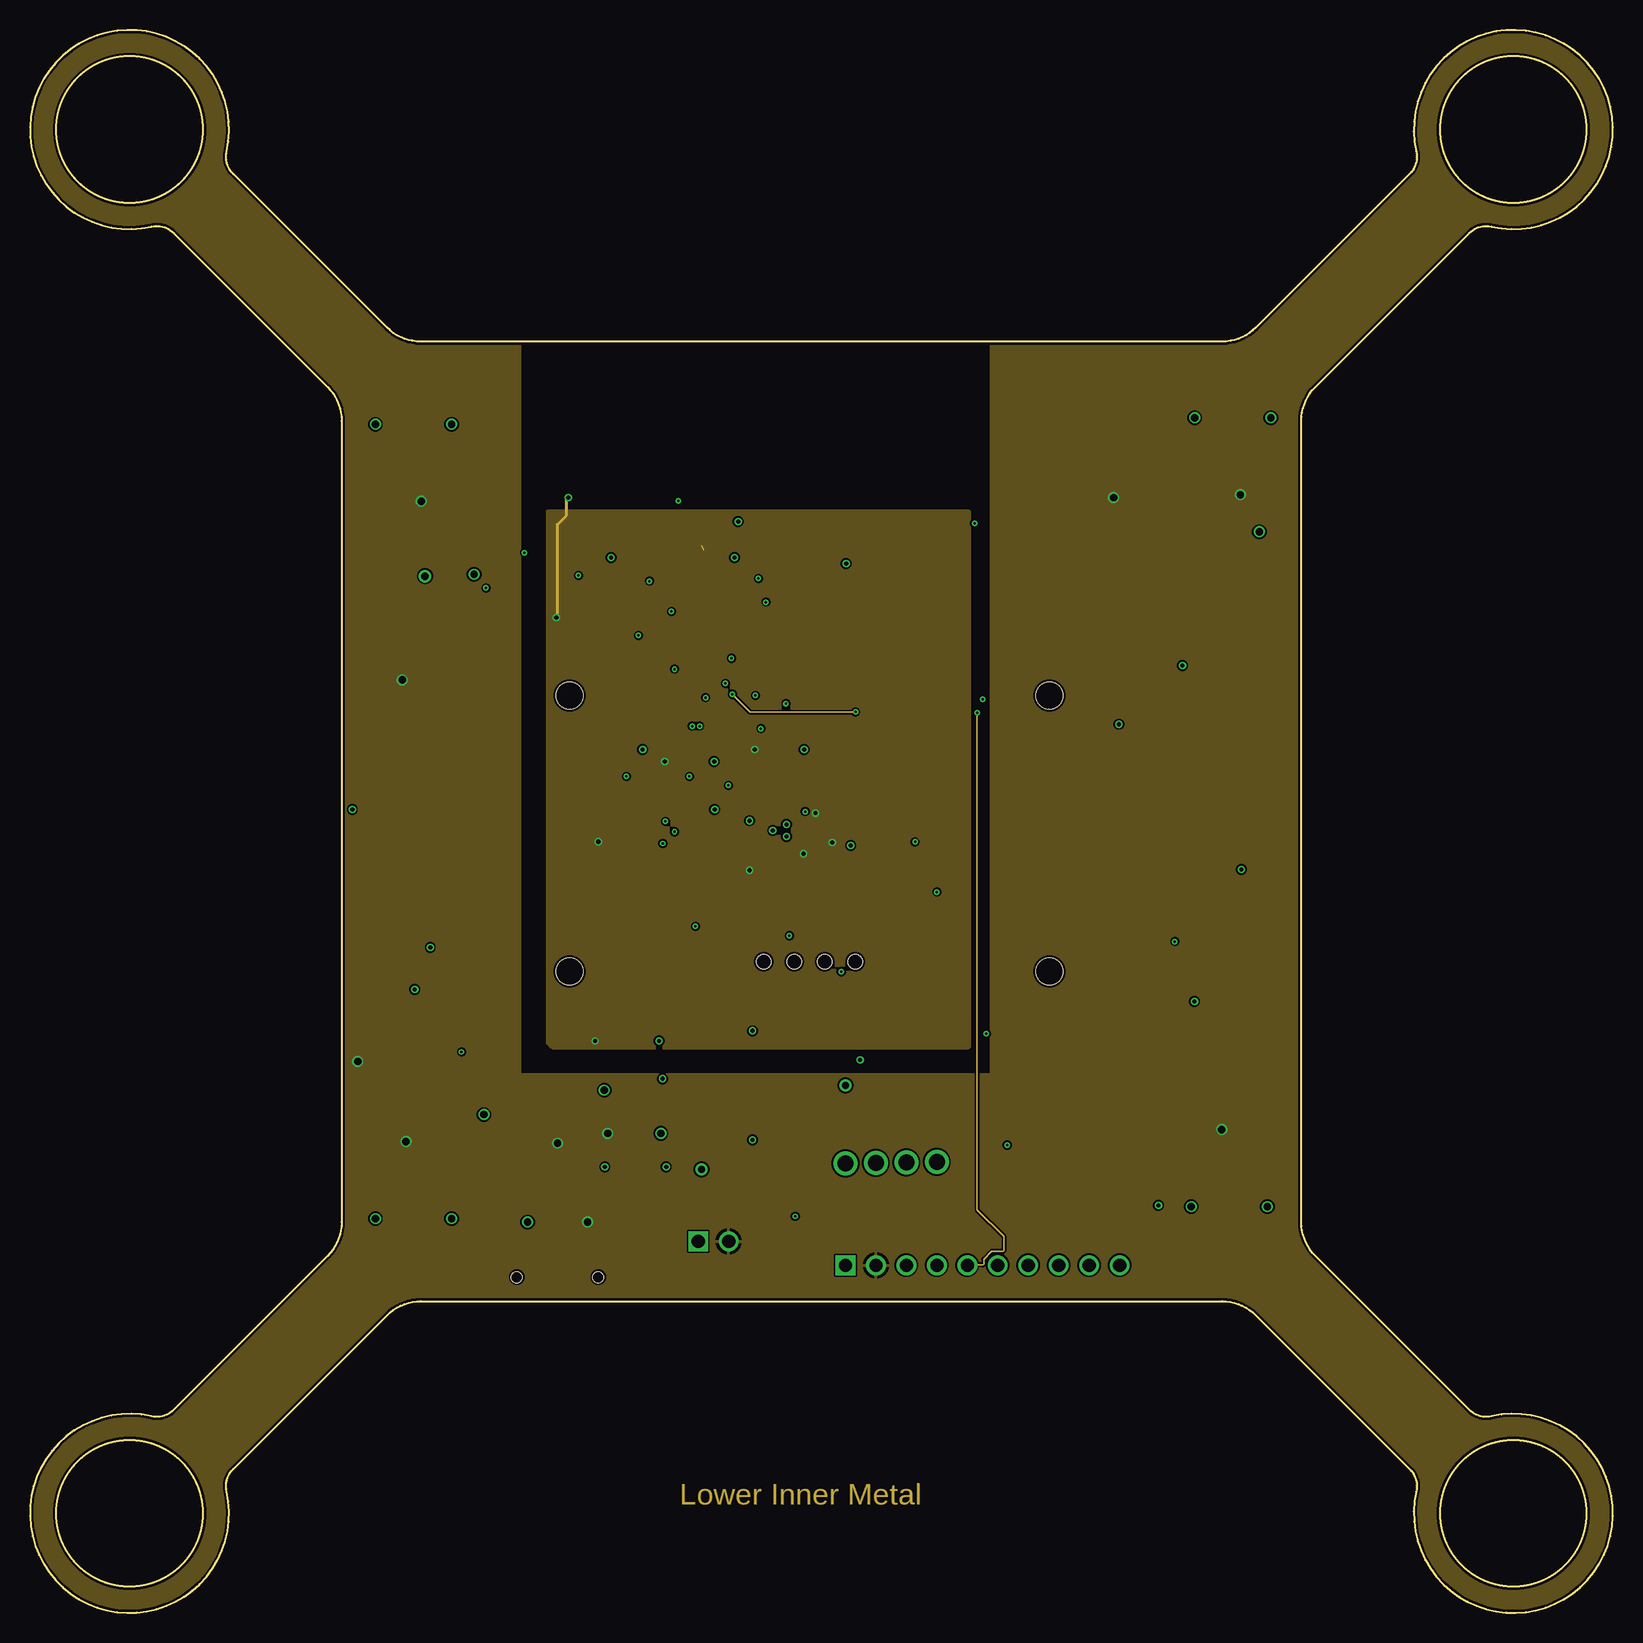
[diagram p4: board, inner layer Route15]
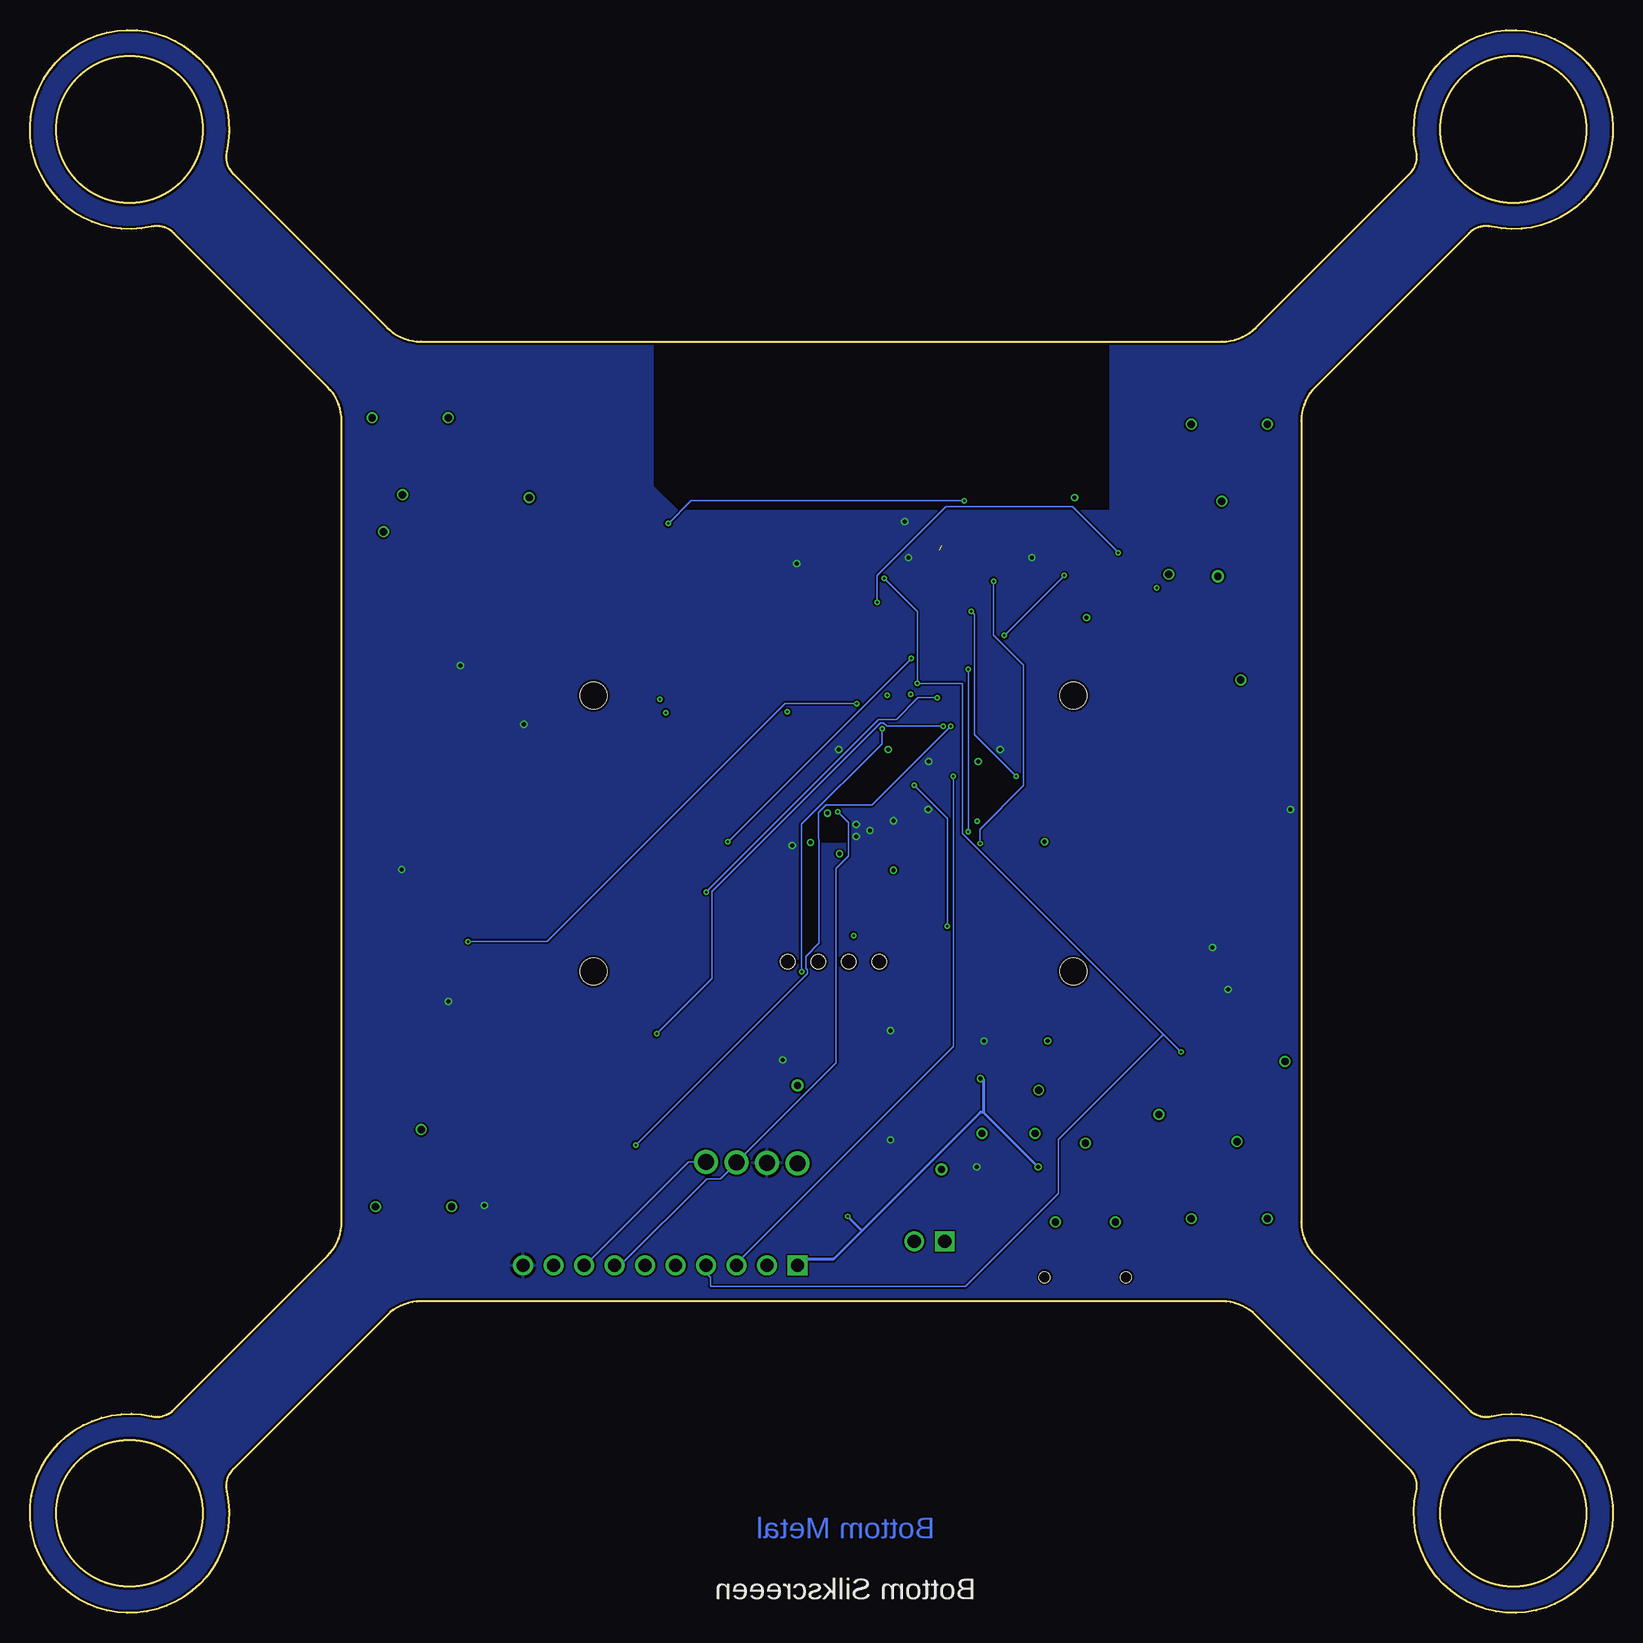
[diagram p5: board, bottom side, seen from below]

Size 131.95 x 131.95 mm. Coordinates in mm from the lower left corner, seen from the top.
Outline: 10.13,16.39 arc295 16.39,10.13 arc-58 16.93,11.98 29.75,24.8 arc-45 32.58,25.97 99.37,25.97 arc-45 102.2,24.8 115.02,11.98 arc-58 115.56,10.13 arc295 121.82,16.39 arc-58 119.97,16.93 107.15,29.75 arc-45 105.97,32.58 105.97,99.37 arc-45 107.15,102.2 119.97,115.02 arc-58 121.82,115.56 arc295 115.56,121.82 arc-58 115.02,119.97 102.2,107.15 arc-45 99.37,105.97 32.58,105.97 arc-45 29.75,107.15 16.93,119.97 arc-58 16.39,121.82 arc295 10.13,115.56 arc-58 11.98,115.02 24.8,102.2 arc-45 25.97,99.37 25.97,32.58 arc-45 24.8,29.75 11.98,16.93 arc-58 10.13,16.39
Outline: circle at 8.3,8.3 radius 6.1
Outline: circle at 8.3,123.65 radius 6.1
Outline: circle at 123.65,8.3 radius 6.1
Outline: circle at 123.65,123.65 radius 6.1
Copper layers (1*2*15*16): Top 0.035559375mm / dielectric 1.501140625mm / Route2 0.035559375mm / dielectric 0.149859375mm / Route15 0.035559375mm / dielectric 0.200659375mm / Bottom 0.035559375mm
Design rules "pcbcart-4layer-5mil-small-cream.dru": minimum track width 5mil, minimum drill 8mil, track to track 6mil, track to pad 6mil, pad to pad 6mil, via to via 6mil, smd to smd 6mil, copper to edge 0.2mm, drill to drill 10mil, minimum pad ring 5mil, minimum via ring 5mil, stop-mask expansion 3mil, vias tented up to drill 0.45mm, thermal gap 10mil

### Footprints (pad centres in the part's own frame; a part is rotated, then mirrored left to right if it is on the bottom)
ANT_PCB_2.4GHZ_NRF8001_1.6MM_1OZ = smd 1.27 x 1.27: FEED 0,0; TESTPOINT -8.169,17.605
BALUN = smd 0.35 x 1: 1 -0.65,-0.8; 2 0,-0.8; 3 0.65,-0.8; 4 0.65,0.8; 5 0,0.8; 6 -0.65,0.8
SCREW-TERMINAL-1X2-2.54MM = drill 1.1 square: 1 -1.27,0 | drill 1.1: 2 1.27,0
TE_FSM8JSMA_HS = smd 1.4 x 2.1: 1 -2.25,4.55; 2 -2.25,-4.55; 3 2.25,4.55; 4 2.25,-4.55
CAPC2012X140_HS = smd 1.08 x 1.42: 1 -0.895,0; 2 0.895,0
CAPMP3216X180 = smd 1.735 x 1.315: 1 -1.34,0; 2 1.34,0
LEDSC125X200X120-2_HS = smd 0.94 x 0.99: A -1.045,0; C 1.045,0
LED_160-1178-1-ND = smd 1.2 x 1.2: A -1.05,0; C 1.05,0
SODFL3516X96 = smd 0.962 x 1.029: 1 -1.525,0; 2 1.525,0
2-56-MOUNTING-HOLE-NO-METAL = hole 2.261: 0,0
2X3-SMD = smd 1 x 3.15: 1 -2.54,-2.54; 2 -2.54,2.54; 3 0,-2.54; 4 0,2.54; 5 2.54,-2.54; 6 2.54,2.54
HDRV10W63P254_10X1_2540X254H838_HS = drill 1.1 pad 1.65 square: 1 0,0 | drill 1.1 pad 1.65: 2 2.54,0; 3 5.08,0; 4 7.62,0; 5 10.16,0; 6 12.7,0; 7 15.24,0; 8 17.78,0; 9 20.32,0; 10 22.86,0
HEADER-1X4-BOTTOM-ENTRY = smd 1.5 x 2.1: 1 3.81,-1.85; 2 1.27,1.85; 3 -1.27,-1.85; 4 -3.81,1.85 | hole 1.2: -1.27,0; -3.81,0; 1.27,0; 3.81,0
HDRVR4W80P254_1X4_1066X254X850B = drill 1.331 pad 1.997: 1 0,0; 2 2.54,0; 3 5.08,0; 4 7.62,0
LEDC1507X80NYELLOW = smd 0.577 x 0.864: A 0.725,0; C -0.725,0
MOLEX-0532610271 = smd 0.8 x 1.6: 1 -0.637,2.9; 2 0.613,2.9 | smd 2.1 x 3: G1 -3.175,0; G2 3.175,0
NETBRIDGE = smd 0.5 x 0.5: BAT_GND -0.3,0; GND 0.3,0
MOSFET_FET_SI2302CDS-T1-E3CT-ND = smd 2.9 x 2.05: D 0,0.875 | smd 1 x 1.5: G -0.95,-1.15; S 0.95,-1.15
RESC2012X60_HS = smd 0.92 x 1.38: 1 -0.955,0; 2 0.955,0
JS102011SAQN = smd 1.2 x 2.5: A -2.5,2.75; B 2.5,2.75; C 0,2.75 | hole 0.9: -3.4,0; 3.4,0
QFN-64 = smd 1.562 x 0.28: 1 -4.881,3.75; 2 -4.881,3.25; 3 -4.881,2.75; 4 -4.881,2.25; 5 -4.881,1.75; 6 -4.881,1.25; 7 -4.881,0.75; 8 -4.881,0.25; 9 -4.881,-0.25; 10 -4.881,-0.75; 11 -4.881,-1.25; 12 -4.881,-1.75; 13 -4.881,-2.25; 14 -4.881,-2.75; 15 -4.881,-3.25; 16 -4.881,-3.75; 33 4.881,-3.75; 34 4.881,-3.25; 35 4.881,-2.75; 36 4.881,-2.25; 37 4.881,-1.75; 38 4.881,-1.25; 39 4.881,-0.75; 40 4.881,-0.25; 41 4.881,0.25; 42 4.881,0.75; 43 4.881,1.25; 44 4.881,1.75; 45 4.881,2.25; 46 4.881,2.75; 47 4.881,3.25; 48 4.881,3.75 | smd 0.28 x 1.562: 17 -3.75,-4.881; 18 -3.25,-4.881; 19 -2.75,-4.881; 20 -2.25,-4.881; 21 -1.75,-4.881; 22 -1.25,-4.881; 23 -0.75,-4.881; 24 -0.25,-4.881; 25 0.25,-4.881; 26 0.75,-4.881; 27 1.25,-4.881; 28 1.75,-4.881; 29 2.25,-4.881; 30 2.75,-4.881; 31 3.25,-4.881; 32 3.75,-4.881; 49 3.75,4.881; 50 3.25,4.881; 51 2.75,4.881; 52 2.25,4.881; 53 1.75,4.881; 54 1.25,4.881; 55 0.75,4.881; 56 0.25,4.881; 57 -0.25,4.881; 58 -0.75,4.881; 59 -1.25,4.881; 60 -1.75,4.881; 61 -2.25,4.881; 62 -2.75,4.881; 63 -3.25,4.881; 64 -3.75,4.881
LSM6DS0 = smd 0.575 x 0.3: 1 -1.163,0.75; 2 -1.163,0.25; 3 -1.163,-0.25; 4 -1.163,-0.75; 8 1.163,-0.75; 9 1.163,-0.25; 10 1.163,0.25; 11 1.163,0.75 | smd 0.3 x 0.575: 5 -0.5,-0.95; 6 0,-0.95; 7 0.5,-0.95; 12 0.5,0.95; 13 0,0.95; 14 -0.5,0.95
SOT23-DBV = smd 0.55 x 1.2: 1 -0.95,-1.3; 2 0,-1.3; 3 0.95,-1.3; 4 0.95,1.3; 5 -0.95,1.3
CRYSTAL-SMD-5X3 = smd 1.9 x 1.1: 1 -1.85,-1.15; 2 1.85,-1.15; 3 1.85,1.15; 4 -1.85,1.15

### Placement (x,y rotation side)
A8  55.97,93.97 270 top
B1  56.96,87.96 270 top
B2  56.97,30.97 0 top
B3  56.47,43.97 0 top
C1  54.97,70.97 0 top
C2  62.47,71.97 0 top
C3  52.47,88.07 180 top
C4  56.97,90.97 0 top
C5  66.97,74.97 180 top
C6  71.97,81.97 90 top
C7  46.37,87.97 0 top
C8  65.97,87.47 0 top
C9  71.47,64.97 0 top
C10  59.97,63.97 90.1 top
C12  85.97,83.47 0 top
C14  43.97,41.97 90 top
C17  49.97,37.17 0 top
C18  50.37,39.97 0 top
C19  49.77,47.67 0 top
D1  98.97,61.97 0 top
D2  54.97,66.97 0 top
D5  100.97,43.97 180 top
D6  92.97,92.97 0 top
D7  38.97,91.97 180 top
D8  29.97,45.97 0 top
H1  84.97,53.47 0 top
H2  44.97,53.47 0 top
H3  84.97,76.47 0 top
H4  44.97,76.47 0 top
J2  82.97,40.97 0 top
J3  67.97,28.97 0 top
J4  64.97,54.27 0 top
J6  67.97,37.47 0.9 top
L1  28.97,72.97 0 top
L2  95.47,55.97 0 top
L3  28.97,60.97 0 top
L4  99.97,70.97 0 top
LOGO  80.97,97.87 0 top
MP1  99.97,35.97 0 top
MP2  100.26,97.51 180 top
MP3  31.97,96.97 180 top
MP4  31.97,34.97 0 top
NB  68.19,46.09 0 top
Q3  93.97,42.97 270 top
Q4  99.97,89.17 90 top
Q5  31.97,88.97 0 top
Q6  37.97,44.97 0 top
R1  46.97,92.97 0 top
R2  47.97,68.97 0 top
R3  92.97,61.97 0 top
R4  49.47,64.27 0 top
R5  45.97,82.97 0 top
R6  92.87,74.07 0 top
R7  39.27,86.57 0 top
R8  48.97,71.97 0 top
R9  29.97,51.97 0 top
R10  93.97,78.97 0 top
R11  91.97,33.97 0 top
R12  35.47,55.47 0 top
R13  28.77,77.77 0 top
R14  94.97,50.97 0 top
R15  28.97,66.97 0 top
S2  43.97,27.97 0 top
U1  56.97,79.97 270 top
U2  64.97,64.97 0 top
U$1  [LAYER_LABELS]  63.97,23.97 0 top
VR1  50.37,43.57 270 top
Y1  66.97,79.97 0 top

### Tracks (layer width: path | path; a pad name or v marks a point on that pad's centre or on a via)
3V  (via drill 0.2, 0.35)
  Top 0.254: VR1.5 48.47,47.72 C19.1 | C9.2 72.22,64.97 70.47,63.22 66.97,63.22 66.97,64.22 v66.88,64.22 | 53.72,70.97 U1.34 53.72,75.97 54.47,76.72 54.47,78.72 | U1.44 58.72,73.47 60.22,71.97 v60.42,71.97 | U1.23 54.47,80.72 54.47,78.72 | 54.47,78.72 60.22,78.72 | 60.22,78.72 U1.54 | U1.59 60.22,81.22 60.22,78.72 | v63.79,33.05 67.91,37.17 67.91,37.45 J6.1
  Top 0.305: R5.1 v43.88,82.97 | C17.1 v47.92,37.17 | R4.1 v47.38,64.27 | v66.88,64.22 U2.8 | U2.5 v64.47,63.28 | U2.12 v65.47,66.67 | C19.1 v47.11,47.67 | C10.1 v59.98,61.91 | C10.1 | R1.1 v44.88,92.97 | VR1.5 v52.73,44.52 | C2.1 v60.42,71.97 | C1.1 53.72,70.97 v52.92,70.97
  Route15 0.254: v44.88,92.97 44.72,92.97 44.72,91.47 43.97,90.72 43.97,82.97 v43.88,82.97
  Bottom 0.254: 52.47,41.72 47.97,37.22 v47.92,37.17 | 52.47,41.72 52.47,44.47 52.72,44.47 v52.73,44.52 | J3.1 67.47,29.47 64.97,29.47 62.59,31.86 | 62.59,31.86 52.72,41.72 52.47,41.72 | 62.59,31.86 v63.79,33.05
  pour Route15: 43.58,47.23 78.22,47.23 78.22,91.72 43.23,91.72 43.23,47.58
BAT_GND  (via drill 0.61 pad 0.76, 0.61 pad 1.02)
  Top 0.5: S2.A v41.47,32.58 | VR1.2 v47.86,43.57 47.6,43.31 C14.2 | R7.1 v37.02,86.57 | C18.2 v52.59,39.97 | MP4.G1 v28.8,32.86 | MP4.G2 v35.15,32.86 | v96.8,33.86 MP1.G1 96.76,36.06 | MP1.G2 v103.15,33.86 | Q4.S v102.48,90.12 | MP3.G1 v35.15,99.08 | MP3.G2 v28.8,99.08 | MP2.G1 v103.44,99.62 | MP2.G2 v97.09,99.62 | 92.84,42 92.84,41.09 96.69,37.24 96.69,36.14 96.76,36.06 | 92.84,42 Q3.S | 96.76,36.06 96.83,36 | NB.BAT_GND 67.89,44.05 v67.97,43.97 | Q3.S 92.84,42.06 92.84,42 | Q6.S 38.92,42.63 v37.84,41.55
  Top 0.813: Q5.S v32.92,86.41
  Top 1.27: B2.1 55.7,36.7 v55.97,36.97
  pour Route2: 80.02,44.91 79.99,44.9 40.96,44.9 40.93,44.91 40.91,44.93 40.9,44.96 40.9,134.9 3.01,134.9 -2.95,128.94 -2.95,1.01 5.01,-6.95 126.94,-6.95 136.9,3.01 136.9,130.94 129.94,137.9 82.01,137.9 80.05,135.94 80.05,44.96 80.04,44.93
BATMEASURE  (via drill 0.2)
  Top 0.127: R13.1 27.97,77.97 30.97,80.97 34.22,80.97 39.72,86.47 40.22,86.47 R7.2 40.25,86.63 40.32,86.7 40.32,87.47 v41.23,88.37 | v61.34,84.25 61.83,83.76 U1.64
  Bottom 0.127: v61.34,84.25 61.34,86.49 55.61,92.22 45.07,92.22 v41.23,88.37
EN
  Top 0.127: S2.C 44.22,30.72 44.22,34.55 46.4,36.73 46.4,39.9 49.07,42.57 VR1.3
GND  (via drill 0.35)
  Top 0.254: U1.7 57.7,84.83 57.7,83.98 57.52,83.8 56.43,83.8 | 56.43,83.8 55.93,83.8 55.75,83.98 55.75,84.83 U1.11 55.7,84.88 55.7,85.77 54.55,86.92 53.03,86.92 51.87,88.07 C3.2 | U1.10 56.22,84 56.43,83.8 | C5.2 62.97,78.08 62.97,79 62.75,79.22 U1.55 61.83,79.25 60.98,79.25 60.8,79.43 60.8,80.52 61,80.72 U1.58 61.88,80.75 62.77,80.75 64.89,82.87 C6.2 | R12.1 v33.38,55.47 | R14.2 v97.07,50.97 | R15.1 v26.88,66.97 | NB.GND v69.2,46.09 | C19.2 v52.44,47.67 | C9.1 69.42,64.97 v68.42,63.97 | C10.2 v59.97,66.03 | C10.2 | R9.2 v32.07,51.97 | C7.2 v48.43,87.97 | C1.2 v57.03,70.97 | R11.2 v94.07,33.97 | v63.07,65.72 U2.1 | v61.92,65.22 U2.2 | v63.07,64.72 U2.3 | C8.2 v68.03,87.47 | B1.5 v58.72,87.96 | C4.2 v59.03,90.97 | B3.3 v60.23,48.52 | B3.4 v60.23,39.42 | R8.2 v51.07,71.97 | C2.2 v64.53,71.97 | R10.2 v96.07,78.97 | R6.1 v90.78,74.07 | D2.C v57.08,66.97 | C17.2 v53.03,37.17 | D1.C v100.97,61.97
  pour Route2: 43.07,47.07 78.87,47.07 78.87,91.87 43.07,91.87
  pour Bottom: 41.9,91.96 41.9,138.9 -5.98,138.9 -6,138.91 -8.95,141.86 -8.95,-7.99 -3.99,-12.95 133.94,-12.95 136.9,-9.99 136.9,134.9 79.16,134.9 80.04,134.02 80.05,133.99 80.05,93.96 80.04,93.93 78.02,91.91 77.99,91.9 41.96,91.9 41.93,91.91 41.91,91.93
  pour Top: 80.02,91.91 79.99,91.9 44.96,91.9 44.93,91.91 44.91,91.93 44.9,91.96 44.9,123.94 9.97,158.87 -13.95,134.94 -13.95,-7.95 150.79,-7.95 134.91,7.93 134.9,7.96 134.9,139.9 107.01,139.9 80.05,112.94 80.05,91.96 80.04,91.93
LED1
  Top 0.127: U1.19 50.97,82.72 49.22,84.47 44.22,84.47 36.47,76.72 29.72,76.72 29.72,72.97 L1.A
LED2  (via drill 0.2)
  Top 0.127: v95.43,55.96 L2.A | v63.02,75.8 62.6,76.22 61.9,76.22 U1.49
  Bottom 0.127: v95.43,55.96 88.86,55.96 69.03,75.8 v63.02,75.8
LED3  (via drill 0.2)
  Top 0.127: v52.97,65.97 52.72,65.72 29.72,65.72 29.72,60.97 L3.A | v60.47,76.47 60.72,76.72 U1.50
  Route2 0.127: v52.97,65.97 60.47,73.47 v60.47,76.47
LED4
  Top 0.127: U1.51 63.22,77.22 63.22,76.22 69.47,69.97 99.47,69.97 100.47,70.97 L4.A
MISO  (via drill 0.2)
  Top 0.127: v56.31,76.29 56.24,76.22 56.24,75.1 U1.39 | v75.59,60.09 75.59,44.79 80.41,39.97 80.41,38.5 J2.1
  Bottom 0.127: v56.31,76.29 57.92,76.29 59.74,74.47 61.2,74.47 v75.59,60.09
MOSI  (via drill 0.2)
  Top 0.127: v55.82,73.92 55.75,73.99 55.75,75.03 U1.38 | v79.71,48.28 82.93,45.07 82.93,43.53 J2.4
  Bottom 0.127: v55.82,73.92 60.5,73.92 60.78,74.19 61.06,74.19 75.1,60.15 75.1,52.89 v79.71,48.28
N$1
  Top 0.127: D1.A 97.72,61.97 96.47,60.72 93.22,60.72 91.97,61.97 R3.1
N$2
  Top 0.127: D2.A 53.72,66.97 52.97,67.72 48.22,67.72 46.97,68.97 R2.1
N$5
  Top 0.254: B1.2 53.48,87.96 C3.1
N$7  (1 unrouted)
  Top 1.27: A8.FEED 55.97,90.97 | 55.97,90.97 C4.1 | 55.97,90.97 55.97,88.97
N$8
  Top 0.127: U1.60 63.22,81.72 64.72,83.22 64.97,83.22 64.97,87.47 C8.1
N$9  (via drill 0.2)
  Top 0.127: v45.72,86.47 45.72,87.97 C7.1 | U1.22 50.97,81.22 v50.72,81.47 50.97,81.72 U1.21
  Bottom 0.127: v50.72,81.47 v45.72,86.47
N$10
  Top 0.254: U1.57 67.92,80.22 Y1.3 71.93,81.12 C6.1
N$11
  Top 0.254: U1.56 64.22,79.72 Y1.1 67.87,76.08 C5.1
N$12
  Top 0.127: L1.C 28.47,72.97 29.97,71.47 29.97,66.97 R15.2
N$13  (via drill 0.2)
  Top 0.127: v79.43,76.15 82.79,79.5 82.93,79.5 86.84,83.41 C12.2 | v63.3,56.45 61.48,56.45 61.2,56.17 J4.4
  Route2 0.127: v79.43,76.15 79.43,72.59 v63.3,56.45
N$14
  Top 0.127: L4.C 99.22,70.97 99.22,73.97 93.97,73.97 R6.2
N$15
  Top 0.127: R14.1 94.72,50.97 94.72,55.97 L2.C
N$16
  Top 0.127: R12.2 35.97,55.47 34.72,56.72 32.72,56.72 28.47,60.97 L3.C
N$18
  Top 0.813: Q3.D 95.85,43.97 D5.2 100.59,42.84 MP1.2
N$19
  Top 0.813: MP2.2 98.01,92.97 D6.2 95.3,92.97 Q4.D
N$20
  Top 0.813: MP3.2 31.36,90.46 Q5.D 35.32,89.85 D7.2
N$21
  Top 0.813: Q6.D 37.85,45.97 D8.2 32.59,44.89 MP4.2
PG0  (via drill 0.2)
  Top 0.127: v73.78,64.28 91.31,64.28 93.54,62.04 93.89,62.04 R3.2 | v58.48,79.57 54.22,83.83 54.22,84.81 U1.14
  Bottom 0.127: v58.48,79.57 v73.78,64.28
PG1  (via drill 0.2)
  Top 0.127: v49.72,69.72 48.97,68.97 R2.2 | v53.47,83.47 53.72,83.72 U1.15
  Bottom 0.127: v49.72,69.72 53.22,73.22 53.22,83.22 v53.47,83.47
PWM1  (via drill 0.2)
  Top 0.127: U1.40 56.72,74.22 57.22,73.72 57.72,73.72 57.72,70.72 56.72,69.72 v54.97,69.72 52.97,69.72 51.97,70.72 49.47,70.72 48.22,71.97 R8.1 | J3.3 73.72,28.97 79.97,35.22 85.76,35.22 91.86,41.32 91.86,42.61 92.82,43.58 Q3.G
  Bottom 0.127: v54.97,69.72 54.97,47.22 72.97,29.22 72.97,28.97 J3.3
PWM2  (via drill 0.2)
  Top 0.127: v60.72,86.22 66.72,92.22 79.97,92.22 84.97,87.22 100.97,87.22 100.97,88.22 Q4.G | v57.97,77.47 57.22,76.72 U1.41 | R9.1 29.22,51.97 34.44,46.76 v35.97,46.76
  Bottom 0.127: v60.72,86.22 57.97,83.47 v57.97,77.47 54.22,77.47 54.22,64.97 37.47,48.22 | 37.47,48.22 46.22,39.47 46.22,34.97 53.97,27.22 75.22,27.22 75.22,27.97 75.47,28.22 75.47,28.97 J3.4 | 37.47,48.22 35.97,46.72 v35.97,46.76
PWM3  (via drill 0.2)
  Top 0.127: v68.82,75.1 78.94,75.1 | 78.94,75.1 79.01,75.1 82.93,79.01 92.98,79.01 R10.1 | v58.55,76.57 58.13,76.57 57.71,76.15 57.71,75.1 U1.42 | v38.01,85.44 32.63,85.44 31.03,87.05 Q5.G | 78.94,75.1 v78.94,75.03
  Route2 0.127: v38.01,85.44 44.16,85.44 52.47,77.13 57.43,77.13 57.99,76.57 v58.55,76.57
  Route15 0.127: v68.82,75.1 60.02,75.1 v58.55,76.57 | v78.94,75.03 78.94,33.61 81.18,31.38 81.18,30.19 81.11,30.12 80.13,30.12 79.5,29.49 79.5,29.07 79.43,29 78.18,29 J3.5
PWM4  (via drill 0.2)
  Top 0.127: R11.1 90.97,33.97 87.22,30.22 82.22,30.22 80.97,28.97 J3.6 79.97,28.97 78.72,27.72 66.97,27.72 65.72,28.97 42.97,28.97 42.97,35.72 37.97,40.72 | v58.22,68.97 U1.43 | v55.47,57.22 54.47,57.22 37.97,40.72 | 37.97,40.72 37.71,40.72 37.17,41.27 37.17,43.68 Q6.G
  Bottom 0.127: v58.22,68.97 55.47,66.22 v55.47,57.22
RESET  (via drill 0.2)
  Top 0.127: J2.5 83.9,36.82 83.9,36.76 83.35,36.2 75.03,36.2 74.33,36.89 74.33,37.94 74.26,38.01 74.26,38.08 74.33,38.15 74.33,38.29 71.68,40.95 55.82,40.95 55.13,40.25 54.29,40.25 B3.2 B3.1 54.29,48.56 54.29,55.13 56.1,56.94 56.1,60.78 v52.75,64.14 | 47.93,92.7 47.93,89.91 51.74,86.1 | 47.93,92.7 47.93,92.91 R1.2 47.93,92.7 | 51.74,86.1 51.77,86.07 54.85,86.07 55.2,85.72 55.2,84.88 U1.12 | v78.73,90.82 85.02,84.53 85.02,83.48 C12.1 | 47.93,92.7 v54.06,92.7 | 51.74,86.1 v51.63,86
  Bottom 0.127: v78.73,90.82 76.85,92.7 v54.06,92.7 | v52.75,64.14 52.75,65.32 49.12,68.96 49.12,79.01 51.63,81.53 v51.63,86
RF_N
  Top 0.254: U1.8 57.22,86.77 B1.4
RF_P
  Top 0.254: U1.9 56.72,86.75 B1.3
RX0
  Top 0.127: U1.46 59.74,75.03 59.74,74.26 59.67,74.19 59.67,74.12 60.57,73.22 65.6,73.22 72.73,66.09 72.94,66.09 73.29,65.74 73.29,63.93 66.3,56.94 66.3,56.17 J4.2
SCK  (via drill 0.2)
  Top 0.127: v55.2,73.92 55.2,75.03 U1.37 | v81.46,38.99 82.3,38.99 82.79,38.5 82.93,38.5 J2.3
  Bottom 0.127: v55.2,73.92 61.76,67.35 65.6,67.35 66.23,66.72 66.23,64.56 66.16,64.49 66.16,55.82 67.28,54.71 67.28,53.73 67.14,53.59 67.14,53.31 v81.46,38.99
SCL  (via drill 0.2)
  Top 0.127: U2.13 64.97,66.09 64.9,66.16 64.9,66.3 64.52,66.69 | 64.52,66.69 62.88,68.33 51.98,68.33 49.96,70.35 49.47,70.35 49.4,70.28 48.14,70.28 47.16,71.26 47.16,75.8 50.62,79.26 | 50.62,79.26 51.14,79.78 51.28,79.78 51.35,79.71 52.05,79.71 U1.25 | 50.62,79.26 46.95,82.93 R5.2 | 64.52,66.69 v64.63,66.79
  Bottom 0.127: J3.7 83.21,29 82.72,29 75.52,36.2 74.4,36.2 73.08,37.52 J6.3 73.01,37.59 64.76,45.84 64.76,62.04 63.72,63.09 63.72,65.88 v64.63,66.79
SDA  (via drill 0.2)
  Top 0.127: 55.65,64.73 55.54,64.63 53.73,64.63 | 55.65,64.73 57.5,66.58 64.21,66.58 64.49,66.3 64.49,65.95 U2.14 | 53.73,64.63 50.79,64.63 R4.2 | v53.73,78.67 53.17,79.22 52.12,79.22 U1.26 | 53.73,64.63 v53.73,65.11 | 55.65,64.73 64.76,55.61 64.76,54.08 75.59,43.25 75.59,37.66 J6.4
  Bottom 0.127: J3.8 85.72,29 85.16,29.56 85.09,29.56 77.06,37.59 75.66,37.59 J6.4 | v53.73,65.11 v53.73,78.67
TX0  (via drill 0.2)
  Top 0.127: v60.92,73.71 60.5,73.71 60.22,73.99 60.22,75.03 U1.47 | v67.63,53.45 68.61,52.47 68.75,52.47 J4.1
  Bottom 0.127: v60.92,73.71 60.92,72.45 67.63,65.74 v67.63,53.45
VBAT  (via drill 0.61 pad 0.76)
  Top 0.5: S2.B v46.47,32.58 | 48.97,39.97 v48.16,39.97 | R13.2 v31.03,77.77 | MP4.1 v31.34,39.28 | v100.9,93.2 MP2.1 | D6.1 v90.33,92.97 | D8.1 v27.33,45.97 | v32.61,92.66 MP3.1 32.84,93.68 37.52,93.68 39.2,92.01 40.46,92.01 D7.1 | v99.34,40.28 MP1.1 99.34,38.78 | 48.97,39.97 49.97,40.97 50.47,40.97 50.47,43.97 49.97,44.47 49.22,44.47 VR1.1 | 48.97,39.97 C18.1 | D5.1 103.53,42.95 103.53,39.83 101.16,37.45 99.69,37.45 99.34,37.8 99.34,38.64 99.34,38.78 | D5.1 | 99.34,38.78 MP1.1 | D5.1 102.55,44.02 D5.1 | C14.1 v43.97,39.16
  Top 1.27: B2.2 59.24,31.97 67.97,31.97 70.51,29.43 J3.2
  pour Route15: 9.05,21.96 9.04,21.93 -7.92,4.97 0.01,-2.95 136.94,-2.95 147.9,8.01 147.9,124.94 127.94,144.9 80.05,144.9 80.05,44.96 80.04,44.93 80.02,44.91 79.99,44.9 40.96,44.9 40.93,44.91 40.91,44.93 40.9,44.96 40.9,114.99 40.91,115.02 42.79,116.9 29.96,116.9 29.93,116.91 0.05,146.79 0.05,135.96 0.04,135.93 -3.95,131.94 -3.95,110.01 9.04,97.02 9.05,96.99
(copper drawn outside any net)
  shapes: Bottom area x1, Route15 area x1, Route2 area x1, Top area x1

### Text on the board
tPlace: 3V GND SCL SDA | 3V VBAT PWM1 PWM2 PWM3 PWM4 SCL SDA BAT_GND GND
tDocu: Kaustubh Kanagalekar | Alexander Haken | Max Height: 132mm / Max Width: 132mm / Motor Holes: 12.2mm / Ring around Motors: 2.2mm